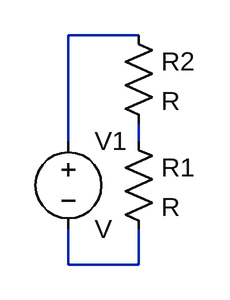
[diagram p0: schematic Draft3.asc]
Draft3.asc, the LTspice schematic file:
Version 4
SHEET 1 880 680
WIRE 96 16 32 16
WIRE 32 112 32 16
WIRE 96 112 96 96
WIRE 32 224 32 192
WIRE 96 224 96 192
WIRE 96 224 32 224
SYMBOL voltage 32 96 R0
SYMATTR InstName V1
SYMBOL res 80 96 R0
SYMATTR InstName R1
SYMBOL res 80 0 R0
SYMATTR InstName R2

The netlist it stands for:
* Draft3.asc
V1 N001 N003 V
R1 N002 N003 R
R2 N001 N002 R
.backanno
.end